# Altium schematic sheet dsp.SchDoc: DSP (TMS320F28388) Connectivity
size A3; SheetNumber: 4; SheetTotal: 18
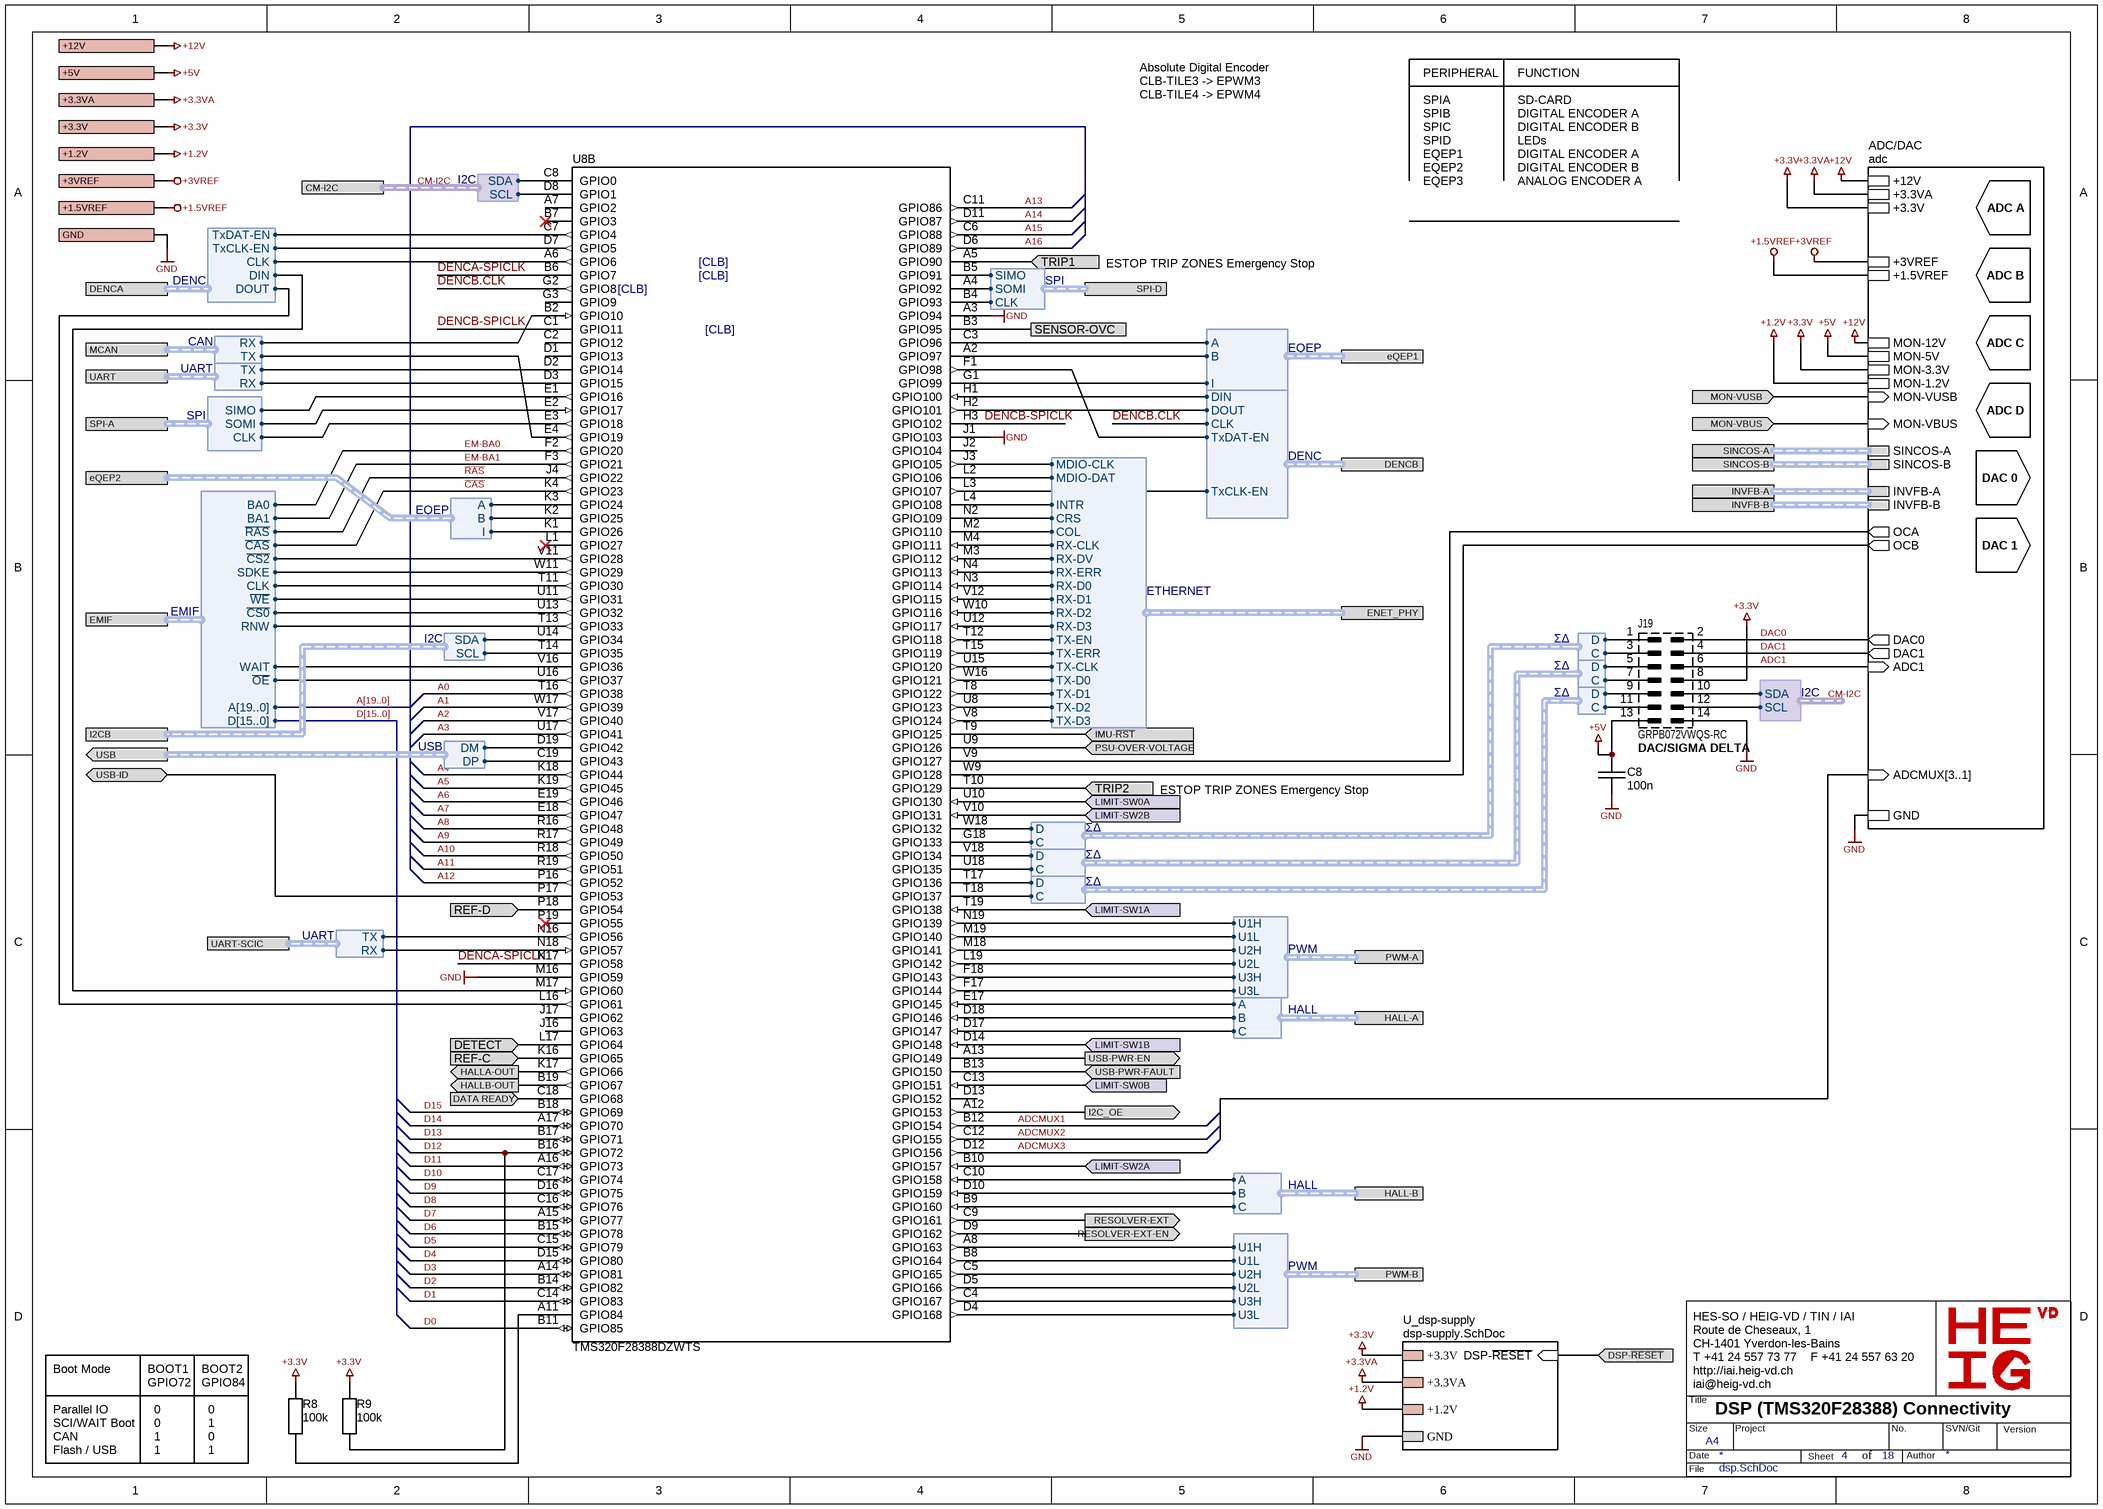
[diagram p0: dsp.SchDoc]

## Parts
C8  100n  [SM/C0402]
J19  GRPB072VWQS-RC  Function: DAC/SIGMA DELTA  [FTSH-107-04-LM-DV]
R8  100k  [SM/R0805]
R9  100k  [SM/R0805]
U8  TMS320F28388DZWTS  [BGA337C80P19X19_1600X1600X140]  (part B of 4)

## Sub-sheets
ADC/DAC = adc: INVFB-A (harness INVFB), INVFB-B (harness INVFB), SINCOS-A (harness SINCOS), SINCOS-B (harness SINCOS), +3.3VA, GND, +3.3V, OCB (out), OCA (out), ADC1 (in), MON-VUSB (in), MON-VBUS (in), DAC1 (out), DAC0 (out), +12V, MON-3.3V, MON-1.2V, MON-5V, MON-12V, +1.5VREF, +3VREF, ADCMUX[3..1] (in)
U_dsp-supply = dsp-supply.SchDoc: +3.3V, GND, +1.2V, +3.3VA, DSP-~{RESET} (in)

## Ports
+1.2V, +1.5VREF, +3.3V, +3.3VA, +3VREF, +5V, +12V, CM-I2C (harness I2C), DATA READY (in), DENCA (harness DENC), DENCB (harness DENC), DETECT (in), DSP-~{RESET} (in), EMIF (harness EMIF), ENET_PHY (harness ETHERNET), eQEP1 (harness EQEP), eQEP2 (harness EQEP), GND, HALL-A (harness HALL), HALL-B (harness HALL), HALLA-OUT (out), HALLB-OUT (out), I2C_OE (out), I2CB (harness I2C), IMU-~{RST} (in), INVFB-A (harness INVFB), INVFB-B (harness INVFB), LIMIT-SW0A (in), LIMIT-SW0B (in), LIMIT-SW1A (in), LIMIT-SW1B (in), LIMIT-SW2A (in), LIMIT-SW2B (in), MCAN (harness CAN), MON-VBUS (in), MON-VUSB (in), PSU-OVER-VOLTAGE (in), PWM-A (harness PWM), PWM-B (harness PWM), REF-C (in), REF-D (in), RESOLVER-EXT (out), RESOLVER-EXT-EN (out), SENSOR-OVC, SINCOS-A (harness SINCOS), SINCOS-B (harness SINCOS), SPI-A (harness SPI), SPI-D (harness SPI), TRIP1 (in), TRIP2 (in), UART (harness UART), UART-SCIC (harness UART), USB (out, harness USB), USB-ID (bidir), USB-PWR-EN (out), USB-PWR-FAULT (in)

## Harnesses
ETHERNET: TX-D0, TX-D1, TX-D2, TX-D3, RX-D0, RX-D1, RX-D2, RX-D3, TX-CLK, TX-EN, RX-CLK, RX-DV, TX-ERR, COL, CRS, RX-ERR, MDIO-CLK, MDIO-DAT, INTR
I2C: SDA, SCL
CAN: RX, TX
USB: DP, DM
EQEP: A, B, I
ΣΔ: C, D
EMIF: A[19..0], D[15..0], ~{RAS}, ~{CAS}, ~{OE}, SDKE, CLK, ~{CS0}, ~{CS2}, BA0, BA1, ~{WE}, RNW, WAIT
UART: TX, RX
PWM: U1H, U1L, U2H, U2L, U3H, U3L
HALL: A, B, C
DENC: CLK, DIN, DOUT, TxCLK-EN, TxDAT-EN
SPI: SIMO, SOMI, CLK

## Nets
+1.2V: port +1.2V, sheet ADC/DAC/MON-1.2V, sheet U_dsp-supply/+1.2V
+1.5VREF: port +1.5VREF, sheet ADC/DAC/+1.5VREF
+3.3V: J19.8 R8.1 R9.1 ; port +3.3V, sheet ADC/DAC/+3.3V, sheet ADC/DAC/MON-3.3V, sheet U_dsp-supply/+3.3V
+3.3VA: port +3.3VA, sheet ADC/DAC/+3.3VA, sheet U_dsp-supply/+3.3VA
+3VREF: port +3VREF, sheet ADC/DAC/+3VREF
+5V: C8.1 J19.13 ; port +5V, sheet ADC/DAC/MON-5V
+12V: port +12V, sheet ADC/DAC/+12V, sheet ADC/DAC/MON-12V
GND: C8.2 J19.14 U8.A3(GPIO94) U8.J1(GPIO103) U8.M16(GPIO59) ; port GND, sheet ADC/DAC/GND, sheet U_dsp-supply/GND
A0: U8.T16(GPIO38)
A1: U8.W17(GPIO39)
A2: U8.V17(GPIO40)
A3: U8.U17(GPIO41)
A4: U8.K18(GPIO44)
A5: U8.K19(GPIO45)
A6: U8.E19(GPIO46)
A7: U8.E18(GPIO47)
A8: U8.R16(GPIO48)
A9: U8.R17(GPIO49)
A10: U8.R18(GPIO50)
A11: U8.R19(GPIO51)
A12: U8.P16(GPIO52)
A13: U8.C11(GPIO86)
A14: U8.D11(GPIO87)
A15: U8.C6(GPIO88)
A16: U8.D6(GPIO89)
ADC1: J19.6 ; sheet ADC/DAC/ADC1
ADCMUX1: U8.B12(GPIO154)
ADCMUX2: U8.C12(GPIO155)
ADCMUX3: U8.D12(GPIO156)
~{CAS}: U8.K4(GPIO23) ; port EMIF.~{CAS}
CM-I2C.SCL: J19.12 U8.D8(GPIO1) ; port CM-I2C.SCL
CM-I2C.SDA: J19.10 U8.C8(GPIO0) ; port CM-I2C.SDA
D0: U8.B11(GPIO85)
D1: U8.C14(GPIO83)
D2: U8.B14(GPIO82)
D3: U8.A14(GPIO81)
D4: U8.D15(GPIO80)
D5: U8.C15(GPIO79)
D6: U8.B15(GPIO78)
D7: U8.A15(GPIO77)
D8: U8.C16(GPIO76)
D9: U8.D16(GPIO75)
D10: U8.C17(GPIO74)
D11: U8.A16(GPIO73)
D12: R9.2 U8.B16(GPIO72)
D13: U8.B17(GPIO71)
D14: U8.A17(GPIO70)
D15: U8.B18(GPIO69)
DAC0: J19.2 ; sheet ADC/DAC/DAC0
DAC1: J19.4 ; sheet ADC/DAC/DAC1
DATA READY: U8.C18(GPIO68) ; port DATA READY
DENCA-SPICLK: U8.B6(GPIO7) U8.N17(GPIO58)
DENCB-SPICLK: U8.C1(GPIO11) U8.H3(GPIO102)
DENCB.CLK: U8.G2(GPIO8) ; port DENCB.CLK
DETECT: U8.L17(GPIO64) ; port DETECT
DSP-~{RESET}: port DSP-~{RESET}, sheet U_dsp-supply/DSP-~{RESET}
EM-BA0: U8.F2(GPIO20) ; port EMIF.BA0
EM-BA1: U8.F3(GPIO21) ; port EMIF.BA1
HALLA-OUT: U8.K17(GPIO66) ; port HALLA-OUT
HALLB-OUT: U8.B19(GPIO67) ; port HALLB-OUT
I2C_OE: U8.A12(GPIO153) ; port I2C_OE
IMU-~{RST}: U8.T9(GPIO125) ; port IMU-~{RST}
LIMIT-SW0A: U8.U10(GPIO130) ; port LIMIT-SW0A
LIMIT-SW0B: U8.C13(GPIO151) ; port LIMIT-SW0B
LIMIT-SW1A: U8.T19(GPIO138) ; port LIMIT-SW1A
LIMIT-SW1B: U8.D14(GPIO148) ; port LIMIT-SW1B
LIMIT-SW2A: U8.B10(GPIO157) ; port LIMIT-SW2A
LIMIT-SW2B: U8.V10(GPIO131) ; port LIMIT-SW2B
MON-VBUS: port MON-VBUS, sheet ADC/DAC/MON-VBUS
MON-VUSB: port MON-VUSB, sheet ADC/DAC/MON-VUSB
PSU-OVER-VOLTAGE: U8.U9(GPIO126) ; port PSU-OVER-VOLTAGE
~{RAS}: U8.J4(GPIO22) ; port EMIF.~{RAS}
REF-C: U8.K16(GPIO65) ; port REF-C
REF-D: U8.P18(GPIO54) ; port REF-D
RESOLVER-EXT: U8.C9(GPIO161) ; port RESOLVER-EXT
RESOLVER-EXT-EN: U8.D9(GPIO162) ; port RESOLVER-EXT-EN
SENSOR-OVC: U8.B3(GPIO95) ; port SENSOR-OVC
TRIP1: U8.A5(GPIO90) ; port TRIP1
TRIP2: U8.T10(GPIO129) ; port TRIP2
USB-ID: U8.P17(GPIO53) ; port USB-ID
USB-PWR-EN: U8.A13(GPIO149) ; port USB-PWR-EN
USB-PWR-FAULT: U8.B13(GPIO150) ; port USB-PWR-FAULT
NetJ19_1: J19.1 U8.W18(GPIO132) ; harness ΣΔ.D
NetJ19_3: J19.3 U8.G18(GPIO133) ; harness ΣΔ.C
NetJ19_5: J19.5 U8.V18(GPIO134) ; harness ΣΔ.D
NetJ19_7: J19.7 U8.U18(GPIO135) ; harness ΣΔ.C
NetJ19_9: J19.9 U8.T17(GPIO136) ; harness ΣΔ.D
NetJ19_11: J19.11 U8.T18(GPIO137) ; harness ΣΔ.C
NetR8_2: R8.2 U8.A11(GPIO84)
NetU8_A2: U8.A2(GPIO97) ; port eQEP1.B
NetU8_A4: U8.A4(GPIO92) ; port SPI-D.SOMI
NetU8_A6: U8.A6(GPIO6) ; port DENCA.CLK
NetU8_A8: U8.A8(GPIO163) ; port PWM-B.U1H
NetU8_B2: U8.B2(GPIO10) ; port MCAN.RX
NetU8_B4: U8.B4(GPIO93) ; port SPI-D.CLK
NetU8_B5: U8.B5(GPIO91) ; port SPI-D.SIMO
NetU8_B8: U8.B8(GPIO164) ; port PWM-B.U1L
NetU8_B9: U8.B9(GPIO160) ; port HALL-B.C
NetU8_C3: U8.C3(GPIO96) ; port eQEP1.A
NetU8_C4: U8.C4(GPIO167) ; port PWM-B.U3H
NetU8_C5: U8.C5(GPIO165) ; port PWM-B.U2H
NetU8_C7: U8.C7(GPIO4) ; port DENCA.TxDAT-EN
NetU8_C10: U8.C10(GPIO158) ; port HALL-B.A
NetU8_C19: U8.C19(GPIO43) ; port USB.DP
NetU8_D2: U8.D2(GPIO14) ; port UART.TX
NetU8_D3: U8.D3(GPIO15) ; port UART.RX
NetU8_D4: U8.D4(GPIO168) ; port PWM-B.U3L
NetU8_D5: U8.D5(GPIO166) ; port PWM-B.U2L
NetU8_D7: U8.D7(GPIO5) ; port DENCA.TxCLK-EN
NetU8_D10: U8.D10(GPIO159) ; port HALL-B.B
NetU8_D17: U8.D17(GPIO147) ; port HALL-A.C
NetU8_D18: U8.D18(GPIO146) ; port HALL-A.B
NetU8_D19: U8.D19(GPIO42) ; port USB.DM
NetU8_E1: U8.E1(GPIO16) ; port SPI-A.SIMO
NetU8_E2: U8.E2(GPIO17) ; port SPI-A.SOMI
NetU8_E3: U8.E3(GPIO18) ; port SPI-A.CLK
NetU8_E4: U8.E4(GPIO19) ; port MCAN.TX
NetU8_E17: U8.E17(GPIO145) ; port HALL-A.A
NetU8_F1: U8.F1(GPIO98) ; port DENCB.TxDAT-EN
NetU8_F17: U8.F17(GPIO144) ; port PWM-A.U3L
NetU8_F18: U8.F18(GPIO143) ; port PWM-A.U3H
NetU8_G1: U8.G1(GPIO99) ; port eQEP1.I
NetU8_H1: U8.H1(GPIO100) ; port DENCB.DIN
NetU8_H2: U8.H2(GPIO101) ; port DENCB.DOUT
NetU8_J3: U8.J3(GPIO105) ; port ENET_PHY.MDIO-CLK
NetU8_K1: U8.K1(GPIO26) ; port eQEP2.I
NetU8_K2: U8.K2(GPIO25) ; port eQEP2.B
NetU8_K3: U8.K3(GPIO24) ; port eQEP2.A
NetU8_L2: U8.L2(GPIO106) ; port ENET_PHY.MDIO-DAT
NetU8_L3: U8.L3(GPIO107) ; port DENCB.TxCLK-EN
NetU8_L4: U8.L4(GPIO108) ; port ENET_PHY.INTR
NetU8_L16: U8.L16(GPIO61) ; port DENCA.DOUT
NetU8_L19: U8.L19(GPIO142) ; port PWM-A.U2L
NetU8_M2: U8.M2(GPIO110) ; port ENET_PHY.COL
NetU8_M3: U8.M3(GPIO112) ; port ENET_PHY.RX-DV
NetU8_M4: U8.M4(GPIO111) ; port ENET_PHY.RX-CLK
NetU8_M17: U8.M17(GPIO60) ; port DENCA.DIN
NetU8_M18: U8.M18(GPIO141) ; port PWM-A.U2H
NetU8_M19: U8.M19(GPIO140) ; port PWM-A.U1L
NetU8_N2: U8.N2(GPIO109) ; port ENET_PHY.CRS
NetU8_N3: U8.N3(GPIO114) ; port ENET_PHY.RX-D0
NetU8_N4: U8.N4(GPIO113) ; port ENET_PHY.RX-ERR
NetU8_N16: U8.N16(GPIO56) ; port UART-SCIC.TX
NetU8_N18: U8.N18(GPIO57) ; port UART-SCIC.RX
NetU8_N19: U8.N19(GPIO139) ; port PWM-A.U1H
NetU8_T8: U8.T8(GPIO122) ; port ENET_PHY.TX-D1
NetU8_T11: U8.T11(GPIO30) ; port EMIF.CLK
NetU8_T12: U8.T12(GPIO118) ; port ENET_PHY.TX-EN
NetU8_T13: U8.T13(GPIO33) ; port EMIF.RNW
NetU8_T14: U8.T14(GPIO35) ; port I2CB.SCL
NetU8_T15: U8.T15(GPIO119) ; port ENET_PHY.TX-ERR
NetU8_U8: U8.U8(GPIO123) ; port ENET_PHY.TX-D2
NetU8_U11: U8.U11(GPIO31) ; port EMIF.~{WE}
NetU8_U12: U8.U12(GPIO117) ; port ENET_PHY.RX-D3
NetU8_U13: U8.U13(GPIO32) ; port EMIF.~{CS0}
NetU8_U14: U8.U14(GPIO34) ; port I2CB.SDA
NetU8_U15: U8.U15(GPIO120) ; port ENET_PHY.TX-CLK
NetU8_U16: U8.U16(GPIO37) ; port EMIF.~{OE}
NetU8_V8: U8.V8(GPIO124) ; port ENET_PHY.TX-D3
NetU8_V9: U8.V9(GPIO127) ; sheet ADC/DAC/OCA
NetU8_V11: U8.V11(GPIO28) ; port EMIF.~{CS2}
NetU8_V12: U8.V12(GPIO115) ; port ENET_PHY.RX-D1
NetU8_V16: U8.V16(GPIO36) ; port EMIF.WAIT
NetU8_W9: U8.W9(GPIO128) ; sheet ADC/DAC/OCB
NetU8_W10: U8.W10(GPIO116) ; port ENET_PHY.RX-D2
NetU8_W11: U8.W11(GPIO29) ; port EMIF.SDKE
NetU8_W16: U8.W16(GPIO121) ; port ENET_PHY.TX-D0

Not connected (* = marked no-connect by the designer): U8 A7(GPIO2) B7(GPIO3)* C2(GPIO12) D1(GPIO13) D13(GPIO152) G3(GPIO9) J2(GPIO104) J16(GPIO63) J17(GPIO62) L1(GPIO27)* P19(GPIO55)*

## Buses and harness runs
bus A[19..0]
bus D[15..0]
harness CM-I2C = port CM-I2C
harness port INVFB-A = sheet ADC/DAC/INVFB-A
harness port INVFB-B = sheet ADC/DAC/INVFB-B
harness port SINCOS-A = sheet ADC/DAC/SINCOS-A
harness port SINCOS-B = sheet ADC/DAC/SINCOS-B

## Notes on the sheet
- SPIA
- SPIB
- PERIPHERAL
- SD-CARD
- DIGITAL ENCODER A
- FUNCTION
- Absolute Digital Encoder
  CLB-TILE3 -> EPWM3
  CLB-TILE4 -> EPWM4
- SPIC
- SPID
- EQEP1
- EQEP2
- EQEP3
- DIGITAL ENCODER B
- LEDs
- ANALOG ENCODER A
- ADC A
- (near U8) [CLB]
- ESTOP TRIP ZONES Emergency Stop
- ADC B
- ADC C
- ADC D
- DAC 0
- DAC 1
- Boot Mode
- BOOT1
- GPIO72
- BOOT2
- GPIO84
- Parallel IO
- SCI/WAIT Boot
- CAN
- Flash / USB
- 0
- 1
- HES-SO / HEIG-VD / TIN / IAI
  Route de Cheseaux, 1
  CH-1401 Yverdon-les-Bains
  T +41 24 557 73 77    F +41 24 557 63 20
  http://iai.heig-vd.ch
  iai@heig-vd.ch
- Title
- Size
- Date
- A4
- Project
- Sheet
- of
- No.
- Author
- SVN/Git
- Version
- File

## Library data of the parts
C8 = CAP CER 100NF 25V X5R 0402: 100 nF ±10% 25V Ceramic Capacitor X5R 0402 (1005 Metric); Voltage: 25V; Dielectric: X5R; Supplier 1: Digi-Key; Supplier Part Number 1: 1276-1043-1-ND; Value: 100n
J19 = CONN HEADER SMD 14POS 1.27MM: Connector Header Surface Mount 14 position 0.050" (1.27mm); Supplier 1: Digi-Key; Supplier Part Number 1: S9012E-07-ND
R8 R9 = RES 100K OHM 1% 1/16W 0402: 100 kOhms ±1% 0.063W, 1/16W Chip Resistor 0402 (1005 Metric) Moisture Resistant Thick Film; Supplier 1: Digi-Key; Supplier Part Number 1: 13-RC0402FR-13100KLCT-ND; Value: 100k
U8 = TMS320F28388DZWTS: C28x C2000™ C28x Fixed-Point Microcontroller IC 32-Bit Dual-Core 200MHz 512KB (256K x 16) FLASH 337-NFBGA (16x16); Manufacturer: Texas Instruments; Datasheet Link: http://www.ti.com/lit/ds/symlink/tms320f28388d.pdf; Height: 1.4mm; Supplier 1: Mouser; Supplier Part Number 1: 595-F28388DZWTS; Manufacturer Part Number: F28388DZWTS